# Altium schematic sheet Spartan.SchDoc
size A4
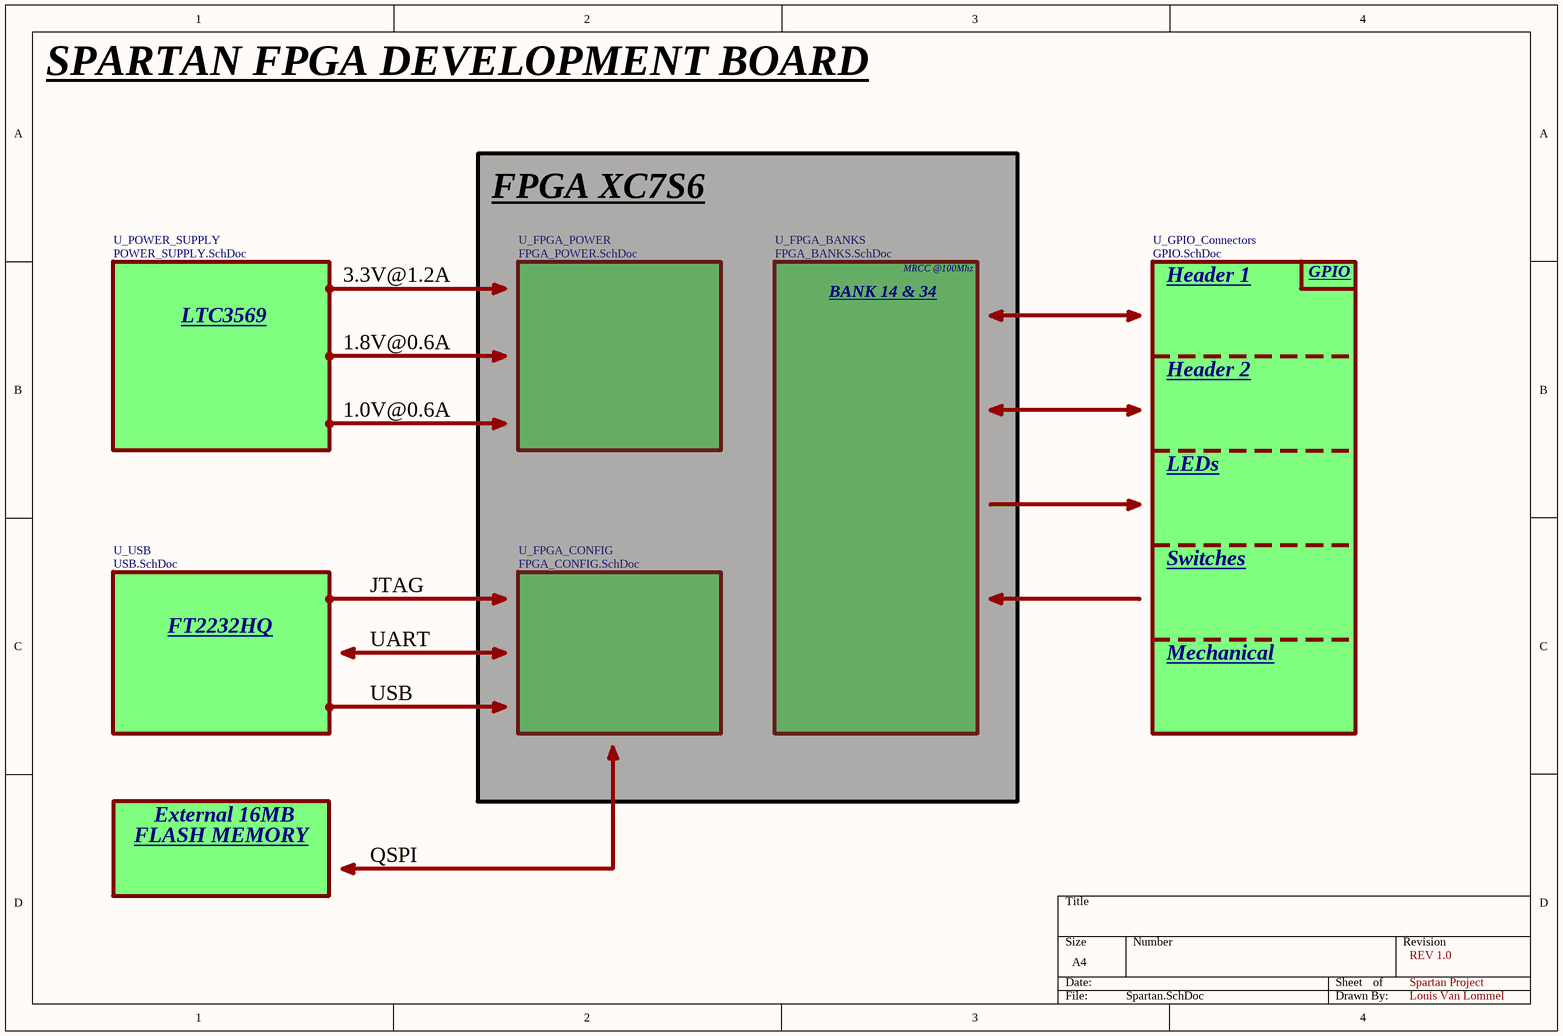
[diagram p0: Spartan.SchDoc]

## Sub-sheets
U_FPGA_BANKS = FPGA_BANKS.SchDoc: no entries
U_FPGA_CONFIG = FPGA_CONFIG.SchDoc: no entries
U_FPGA_POWER = FPGA_POWER.SchDoc: no entries
U_GPIO_Connectors = GPIO.SchDoc: no entries
U_POWER_SUPPLY = POWER_SUPPLY.SchDoc: no entries
U_USB = USB.SchDoc: no entries

## Notes on the sheet
- SPARTAN FPGA DEVELOPMENT BOARD
- FPGA XC7S6
- 3.3V@1.2A
- BANK 14 & 34
- MRCC @100Mhz
- Header 1
- GPIO
- LTC3569
- 1.8V@0.6A
- Header 2
- 1.0V@0.6A
- LEDs
- Switches
- FT2232HQ
- JTAG
- UART
- USB
- Mechanical
- FLASH MEMORY
- External 16MB
- QSPI
- REV 1.0
- Spartan Project
- Louis Van Lommel